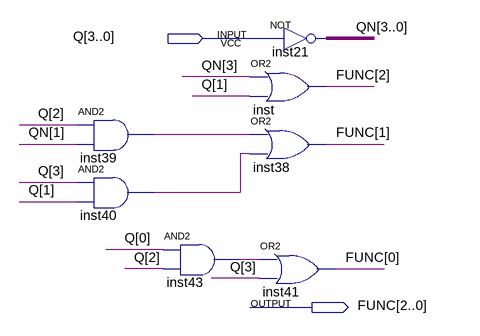
[diagram p0: schematic sheet]
// Quartus schematic FUNC.bdf as structural Verilog: 7 symbols, 2 pins
module FUNC (
  input  [3:0] Q,
  output [2:0] FUNC
);

  wire inst39_out, inst40_out, inst43_out;
  wire [3:0] QN;

  and inst39 (inst39_out, Q[2], QN[1]);
  and inst40 (inst40_out, Q[3], Q[1]);
  and inst43 (inst43_out, Q[0], Q[2]);
  or inst (FUNC[2], QN[3], Q[1]);
  or inst38 (FUNC[1], inst39_out, inst40_out);
  or inst41 (FUNC[0], inst43_out, Q[3]);
  assign QN = ~Q;  // NOT inst21, 4 bits wide
endmodule
